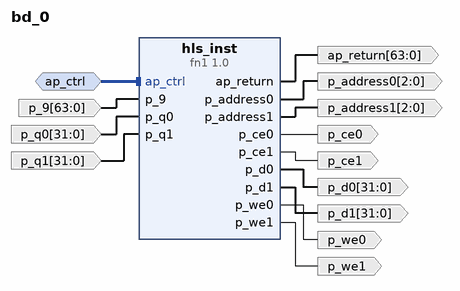
[diagram p0: block diagram of the top level]
# Vivado block design bd_0, xc7z020clg484-1, Vivado 2020.2
create_bd_design bd_0

create_bd_intf_port -mode Slave -vlnv xilinx.com:interface:acc_handshake_rtl:1.0 ap_ctrl
create_bd_port -dir O -from 63 -to 0 -type data ap_return
create_bd_port -dir I -from 63 -to 0 -type data p_9
create_bd_port -dir O -from 2 -to 0 -type data p_address0
create_bd_port -dir O -from 2 -to 0 -type data p_address1
create_bd_port -dir O p_ce0
create_bd_port -dir O p_ce1
create_bd_port -dir O -from 31 -to 0 -type data p_d0
create_bd_port -dir O -from 31 -to 0 -type data p_d1
create_bd_port -dir I -from 31 -to 0 -type data p_q0
create_bd_port -dir I -from 31 -to 0 -type data p_q1
create_bd_port -dir O p_we0
create_bd_port -dir O p_we1

create_bd_cell -type ip -vlnv xilinx.com:hls:fn1:1.0 hls_inst

# ---- connections ----

connect_bd_intf_net -intf_net ap_ctrl_0_1 [get_bd_intf_ports ap_ctrl] [get_bd_intf_pins hls_inst/ap_ctrl]
connect_bd_net [get_bd_pins hls_inst/ap_return] [get_bd_ports ap_return]
connect_bd_net -net p_9_0_1 [get_bd_ports p_9] [get_bd_pins hls_inst/p_9]
connect_bd_net [get_bd_pins hls_inst/p_address0] [get_bd_ports p_address0]
connect_bd_net [get_bd_pins hls_inst/p_address1] [get_bd_ports p_address1]
connect_bd_net [get_bd_pins hls_inst/p_ce0] [get_bd_ports p_ce0]
connect_bd_net [get_bd_pins hls_inst/p_ce1] [get_bd_ports p_ce1]
connect_bd_net [get_bd_pins hls_inst/p_d0] [get_bd_ports p_d0]
connect_bd_net [get_bd_pins hls_inst/p_d1] [get_bd_ports p_d1]
connect_bd_net -net p_q0_0_1 [get_bd_ports p_q0] [get_bd_pins hls_inst/p_q0]
connect_bd_net -net p_q1_0_1 [get_bd_ports p_q1] [get_bd_pins hls_inst/p_q1]
connect_bd_net [get_bd_pins hls_inst/p_we0] [get_bd_ports p_we0]
connect_bd_net [get_bd_pins hls_inst/p_we1] [get_bd_ports p_we1]

validate_bd_design
save_bd_design
